# EAGLE design isd1820-test-bilbo (EAGLE 9.6.2)
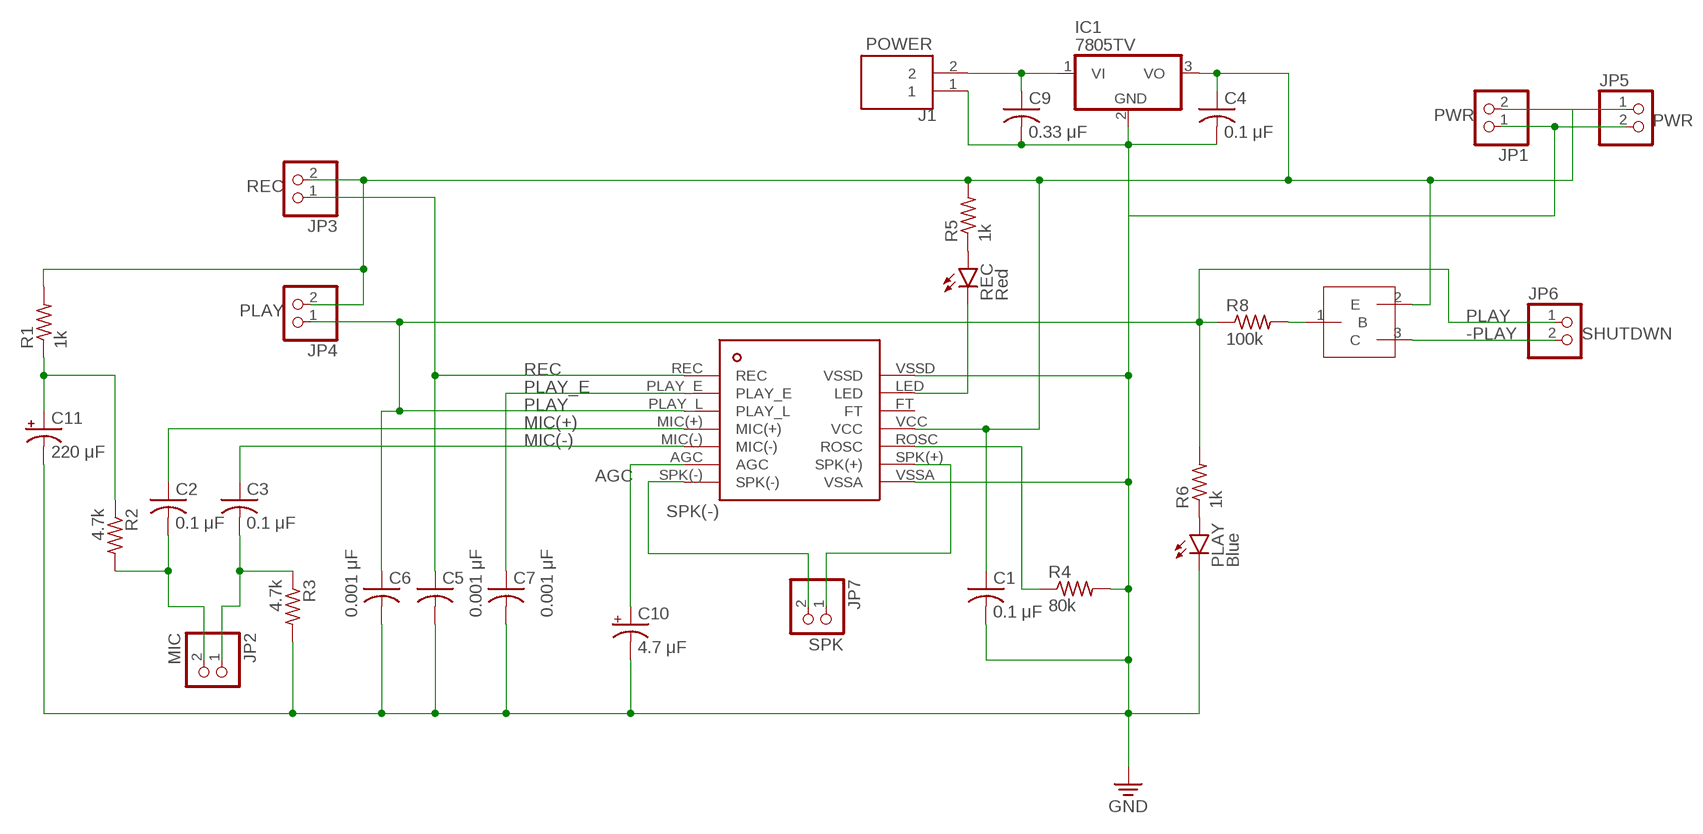
[diagram p0: schematic, sheet 1]

## Parts
C1  0.1 μF  C-USC0805  [C0805]
C2  0.1 μF  C-USC0805  [C0805]
C3  0.1 μF  C-USC0805  [C0805]
C4  0.1 μF  C-USC0805  [C0805]
C5  0.001 μF  C-USC0805  [C0805]
C6  0.001 μF  C-USC0805  [C0805]
C7  0.001 μF  C-USC0805  [C0805]
C9  0.33 μF  C-USC0805  [C0805]
C10  4.7 μF  CPOL-USE2.5-5  [E2,5-5]
C11  220 μF  CPOL-USE2.5-5  [E2,5-5]
IC1  7805TV  [TO220V]
J1  POWER  TB004-508-02BE  [CUI_TB004-508-02BE]
JP1  PWR  PINHD-1X2  [1X02]
JP2  MIC  PINHD-1X2  [1X02]
JP3  REC  PINHD-1X2  [1X02]
JP4  PLAY  PINHD-1X2  [1X02]
JP5  PWR  PINHD-1X2  [1X02]
JP6  SHUTDWN  PINHD-1X2  [1X02]
JP7  SPK  PINHD-1X2  [1X02]
PLAY  Blue  LEDCHIP-LED0805  [CHIP-LED0805]
R1  1k  R-US_R0805  [R0805]
R2  4.7k  R-US_R0805  [R0805]
R3  4.7k  R-US_R0805  [R0805]
R4  80k  R-US_R0805  [R0805]
R5  1k  R-US_R0805  [R0805]
R6  1k  R-US_R0805  [R0805]
R8  100k  R-US_R0805  [R0805]
REC  Red  LEDCHIP-LED0805  [CHIP-LED0805]
U$1  ISD1820PY  [ISD1820PY]
U$2  PNP  2PB709ARL,235  [SOT95P230X110-3N]

## Nets
+5V: C1.1 C4.1 IC1.3(VO) JP1.2 JP3.2 JP4.2 JP5.1 R1.2 R5.2 U$1.VCC U$2.2(E)
-PLAY: JP6.2 U$2.3(C)
AGC: C10.+ U$1.AGC
GND: C1.2 C4.2 C5.2 C6.2 C7.2 C9.2 C10.- C11.- IC1.2(GND) J1.1 JP1.1 JP5.2 PLAY.C R3.2 R4.2 U$1.VSSA U$1.VSSD
MIC(+): C2.1 U$1.MIC(+)
MIC(-): C3.1 U$1.MIC(-)
N$1: PLAY.A R6.1
N$2: JP7.1 U$1.SPK(+)
N$3: R8.2 U$2.1(B)
N$5: R4.1 U$1.ROSC
N$8: C9.1 IC1.1(VI) J1.2
N$11: C3.2 JP2.1 R3.1
N$12: C2.2 JP2.2 R2.2
N$13: C11.+ R1.1 R2.1
N$15: R5.1 REC.A
N$17: REC.C U$1.LED
PLAY: C6.1 JP4.1 JP6.1 R6.2 R8.1 U$1.PLAY_L
PLAY_E: C7.1 U$1.PLAY_E
REC: C5.1 JP3.1 U$1.REC
SPK(-): JP7.2 U$1.SPK(-)
Unconnected: U$1.FT

## Library data of the parts
C1-C7 C9 = rcl:C-US: CAPACITOR, American symbol; SPICEPREFIX: C
C10 C11 = adafruit:CPOL-US: POLARIZED CAPACITOR, American symbol
IC1 = linear:78*: Positive VOLTAGE REGULATOR Source: http://cache.national.com/ds/LM/LM78L05.pdf http://www.fairchildsemi.com/ds/LM/LM7805.pdf
J1 = TB004-508-02BE:TB004-508-02BE: Screw Terminal 5.08 pitch Check availability <https://pricing.snapeda.com/parts/TB004-508-02BE/CUI%20Devices/view-part?ref=eda>; AVAILABILITY: In Stock; CUI_PURCHASE_URL: https://www.cuidevices.com/product/interconnect/connectors/terminal-blocks/tb004-508-series?utm_source=snapeda.com&utm_medium=referral&utm_campaign=snapedaBOM; DESCRIPTION: 2~24 Poles, Screw Type, Horizontal, 5.08 Pitch, 24~12 (AWG), Terminal Block Connector; MF: CUI Devices; MP: TB004-508-02BE; PACKAGE: None; PRICE: None; PURCHASE-URL: https://pricing.snapeda.com/search/part/TB004-508-02BE/?ref=eda
JP1-JP7 = pinhead:PINHD-1X2: PIN HEADER
PLAY REC = led:LED: LED OSRAM: - CHIPLED LG R971, LG N971, LY N971, LG Q971, LY Q971, LO R971, LY R971 LH N974, LH R974 LS Q976, LO Q976, LY Q976 LO Q996 - Hyper CHIPLED LW Q18S LB Q993, LB Q99A, LB R99A - SideLED LS A670, LO A670, LY A670, LG A670, LP A670 LB A673, LV A673, LT A673, LW A673 LH A674 LY A675 LS A676, LA A676, LO A676, LY A676, LW A676 LS A679, LY A679, LG A679 - Hyper Micro SIDELED® LS Y876, LA Y876, LO Y876, LY Y876 LT Y87S - SmartLED LW L88C, LW L88S LB L89C, LB L89S, LG L890 LS L89K, LO L89K, LY L89K LS L896, LA L896, LO L896, LY L896 - TOPLED LS T670, LO T670, LY T670, LG T670, LP T670 LSG T670, LSP T670, LSY T670, LOP T670, LYG T670 LG T671, LOG T671, LSG T671 LB T673, LV T673, LT T673, LW T673 LH T674 LS T676, LA T676, LO T676, LY T676, LB T676, LH T676, LSB T676, LW T676 LB T67C, LV T67C, LT T67C, LS T67K, LO T67K, LY T67K, LW E67C LS E67B, LA E67B, LO E67B, LY E67B, LB E67C, LV E67C, LT E67C LW T67C LS T679, LY T679, LG T679 LS T770, LO T770, LY T770, LG T770, LP T770 LB T773, LV T773, LT T773, LW T773 LH T774 LS E675, LA E675, LY E675, LS T675 LS T776, LA T776, LO T776, LY T776, LB T776 LHGB T686 LT T68C, LB T68C - Hyper Mini TOPLED® LB M676 - Mini TOPLED Santana® LG M470 LS M47K, LO M47K, LY M47K Source: http://www.osram.convergy.de LUXEON: - LUMILED® LXK2-PW12-R00, LXK2-PW12-S00, LXK2-PW14-U00, LXK2-PW14-V00 LXK2-PM12-R00, LXK2-PM12-S00, LXK2-PM14-U00 LXK2-PE12-Q00, LXK2-PE12-R00, LXK2-PE12-S00, LXK2-PE14-T00, LXK2-PE14-U00 LXK2-PB12-K00, LXK2-PB12-L00, LXK2-PB12-M00, LXK2-PB14-N00, LXK2-PB14-P00, LXK2-PB14-Q00 LXK2-PR12-L00, LXK2-PR12-M00, LXK2-PR14-Q00, LXK2-PR14-R00 LXK2-PD12-Q00, LXK2-PD12-R00, LXK2-PD12-S00 LXK2-PH12-R00, LXK2-PH12-S00 LXK2-PL12-P00, LXK2-PL12-Q00, LXK2-PL12-R00 Source: www.luxeon.com KINGBRIGHT: KA-3528ASYC Source: www.kingbright.com
R1-R6 R8 = rcl:R-US_: RESISTOR, American symbol; SPICEPREFIX: R
U$1 = isd1820py:ISD1820PY
U$2 = 2PB709ARL,235-SOT23:2PB709ARL,235

## Board
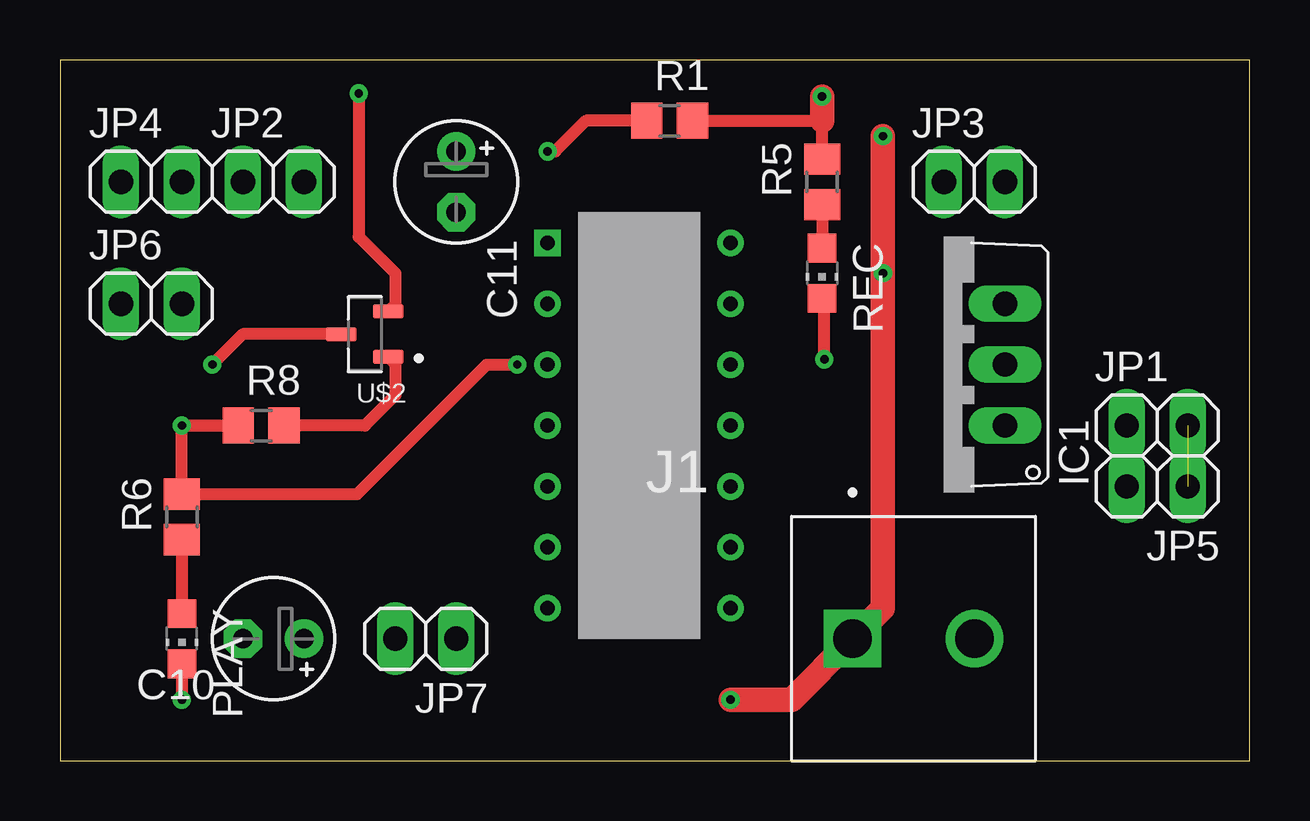
[diagram p1: board, top side]
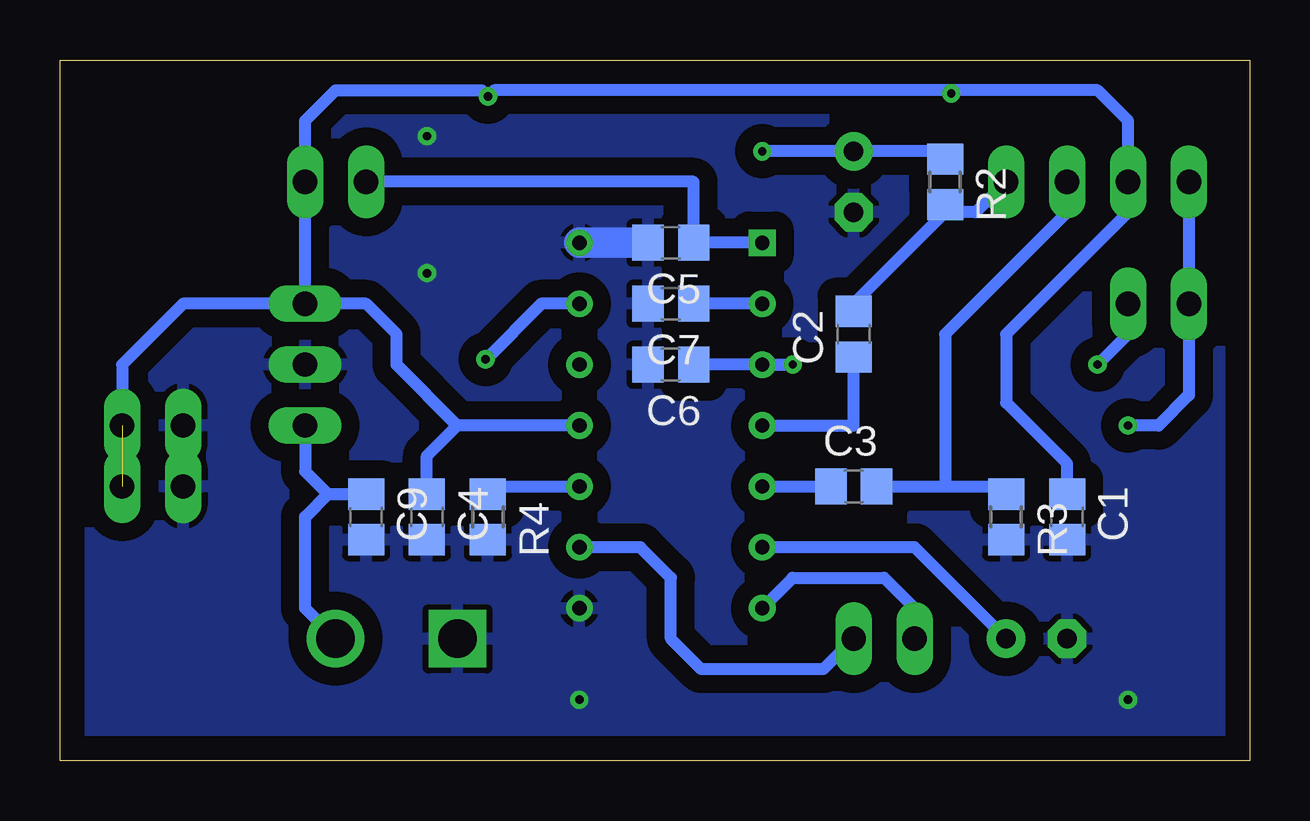
[diagram p2: board, bottom side, seen from below]

Size 49.58 x 29.21 mm. Coordinates in mm from the lower left corner, seen from the top.
Outline: 0,0 49.58,0 49.58,29.21 0,29.21 0,0
Copper layers (1*16): Top 0.035mm / dielectric 1.5mm / Bottom 0.035mm
Design rules "default": minimum track width 6mil, minimum drill 0.35mm, track to track 6mil, track to pad 6mil, pad to pad 6mil, via to via 6mil, smd to smd 6mil, copper to edge 40mil, drill to drill 6mil, minimum pad ring 10mil, minimum via ring 8mil, stop-mask expansion 4mil, vias tented up to drill 0mil, thermal gap 10mil

### Footprints (pad centres in the part's own frame; a part is rotated, then mirrored left to right if it is on the bottom)
C0805 = smd 1.3 x 1.5: 1 -0.95,0; 2 0.95,0
E2,5-5 = drill 0.813 pad 1.6: + -1.27,0 | drill 0.813 pad 1.6 octagon: - 1.27,0
TO220V = drill 1.016 long: 1 -2.54,-2.54; 2 0,-2.54; 3 2.54,-2.54
CUI_TB004-508-02BE = drill 1.6 square: 1 0,0 | drill 1.6: 2 5.08,0
1X02 = drill 1.016 long: 1 -1.27,0; 2 1.27,0
CHIP-LED0805 = smd 1.2 x 1.2: A 0,-1.05; C 0,1.05
R0805 = smd 1.3 x 1.5: 1 -0.95,0; 2 0.95,0
ISD1820PY = drill 0.6: AGC -3.81,-5.08; FT 3.81,2.54; LED 3.81,5.08; MIC(+) -3.81,0; MIC(-) -3.81,-2.54; PLAY_E -3.81,5.08; PLAY_L -3.81,2.54; ROSC 3.81,-2.54; SPK(+) 3.81,-5.08; SPK(-) -3.81,-7.62; VCC 3.81,0; VSSA 3.81,-7.62; VSSD 3.81,7.62 | drill 0.6 square: REC -3.81,7.62
SOT95P230X110-3N = smd 1.26 x 0.59: 1 -0.98,0.95; 2 -0.98,-0.95; 3 0.98,0

### Placement (x,y rotation side)
C1  7.62,10.16 270 bottom
C2  16.51,17.78 90 bottom
C3  16.51,11.43 0 bottom
C4  34.29,10.16 270 bottom
C5  24.13,21.59 180 bottom
C6  24.13,16.51 180 bottom
C7  24.13,19.05 180 bottom
C9  36.83,10.16 270 bottom
C10  8.89,5.08 180 top
C11  16.51,24.13 270 top
IC1  36.83,16.51 90 top
J1  33.02,5.08 0 top
JP1  45.72,13.97 0 top
JP2  8.89,24.13 0 top
JP3  38.1,24.13 0 top
JP4  3.81,24.13 0 top
JP5  45.72,11.43 180 top
JP6  3.81,19.05 0 top
JP7  15.24,5.08 180 top
PLAY  5.08,5.08 180 top
R1  25.4,26.67 0 top
R2  12.7,24.13 270 bottom
R3  10.16,10.16 270 bottom
R4  31.75,10.16 270 bottom
R5  31.75,24.13 90 top
R6  5.08,10.16 90 top
R8  8.38,13.97 0 top
REC  31.75,20.32 180 top
U$1  24.13,13.97 0 top
U$2  12.7,17.78 180 top

### Tracks (layer width: path | path; a pad name or v marks a point on that pad's centre or on a via)
+5V  (via drill 0.35)  (1 unrouted)
  Top 0.508: R1.2 31.43,26.67 | 31.43,26.67 31.75,26.67 | 31.43,26.67 31.75,26.35 R5.2 | v12.45,27.82 12.45,21.84 13.97,20.32 13.97,19.02 U$2.2
  Top 1.016: v31.75,27.69 31.75,26.67
  Bottom 0.508: 38.1,19.05 IC1.3 | U$1.VCC 33.02,13.97 | IC1.3 44.45,19.05 46.99,16.51 JP1.2 | C1.1 7.62,12.38 10.16,14.92 10.16,17.78 5.08,22.86 JP4.2 5.08,26.67 6.35,27.94 12.32,27.94 v12.45,27.82 12.57,27.94 31.5,27.94 v31.75,27.69 32,27.94 38.1,27.94 39.37,26.67 JP3.2 IC1.3 | C4.1 34.29,12.7 33.02,13.97 | IC1.3 36.83,19.05 35.56,17.78 35.56,16.51 33.02,13.97
-PLAY  (via drill 0.35)
  Top 0.508: U$2.3 7.62,17.78 v6.35,16.51
  Bottom 0.508: v6.35,16.51 5.08,17.78 JP6.2
AGC
  Bottom 0.508: U$1.AGC 13.97,8.89 C10.+
GND  (via drill 0.35)
  Top 0.508: PLAY.C v5.08,2.54
  Top 1.016: v34.29,26.04 v34.29,20.32 34.29,6.35 J1.1 30.48,2.54 v27.94,2.54
  Bottom 0.254: C6.2 25.4,16.51
  Bottom 1.27: U$1.VSSD C5.2
  pour Bottom (isolate 0.745): 0,0 0,29.21 49.53,29.21 49.53,0
MIC(+)
  Bottom 0.508: U$1.MIC(+) 16.51,13.97 C2.1
MIC(-)
  Bottom 0.508: U$1.MIC(-) C3.1
N$1
  Top 0.508: R6.1 PLAY.A
N$2
  Bottom 0.508: JP7.1 17.78,3.81 22.86,3.81 24.13,5.08 24.13,7.62 25.4,8.89 U$1.SPK(+)
N$3
  Top 0.508: 9.33,14.41 R8.2 12.7,13.97 13.97,15.24 13.97,16.54 U$2.1
N$5
  Bottom 0.508: R4.1 32.14,11.43 U$1.ROSC
N$8
  Bottom 0.508: J1.2 39.37,6.35 39.37,10.16 38.42,11.11 | 38.42,11.11 C9.1 | 38.42,11.11 39.37,12.06 IC1.1
N$11
  Bottom 0.508: C3.2 12.7,11.43 | 12.7,11.43 10.48,11.43 R3.1 9.84,11.43 | 12.7,11.43 12.7,17.78 7.62,22.86 JP2.1
N$12
  Bottom 0.508: C2.2 16.51,19.05 12.7,22.86 | 12.7,22.86 R2.2 | JP2.2 11.43,22.86 12.7,22.86
N$13  (via drill 0.35)
  Top 0.508: R1.1 21.91,26.67 20.64,25.4 v20.32,25.4
  Bottom 0.508: v20.32,25.4 C11.+ 13.02,25.4 R2.1
N$15
  Top 0.508: R5.1 REC.A
N$17  (via drill 0.35)
  Top 0.508: 31.53,19.05 REC.C 31.85,19.17 v31.85,16.73
  Bottom 0.508: v31.85,16.73 29.53,19.05 U$1.LED
PLAY  (via drill 0.35)
  Top 0.508: v19.05,16.51 17.78,16.51 12.38,11.11 R6.2 v5.08,13.97 R8.1 7.3,13.84
  Bottom 0.508: v19.05,16.51 U$1.PLAY_L C6.1 | v5.08,13.97 3.81,13.97 2.54,15.24 JP6.1 JP4.1
PLAY_E
  Bottom 0.508: U$1.PLAY_E C7.1
REC
  Bottom 0.508: U$1.REC C5.1 23.18,24.13 JP3.1
SPK(-)
  Bottom 0.508: JP7.2 13.97,6.35 15.24,7.62 19.05,7.62 U$1.SPK(-)

### Text on the board
Notes: +5v